# EAGLE design BLDC_logic_v2 (EAGLE 9.6.2)
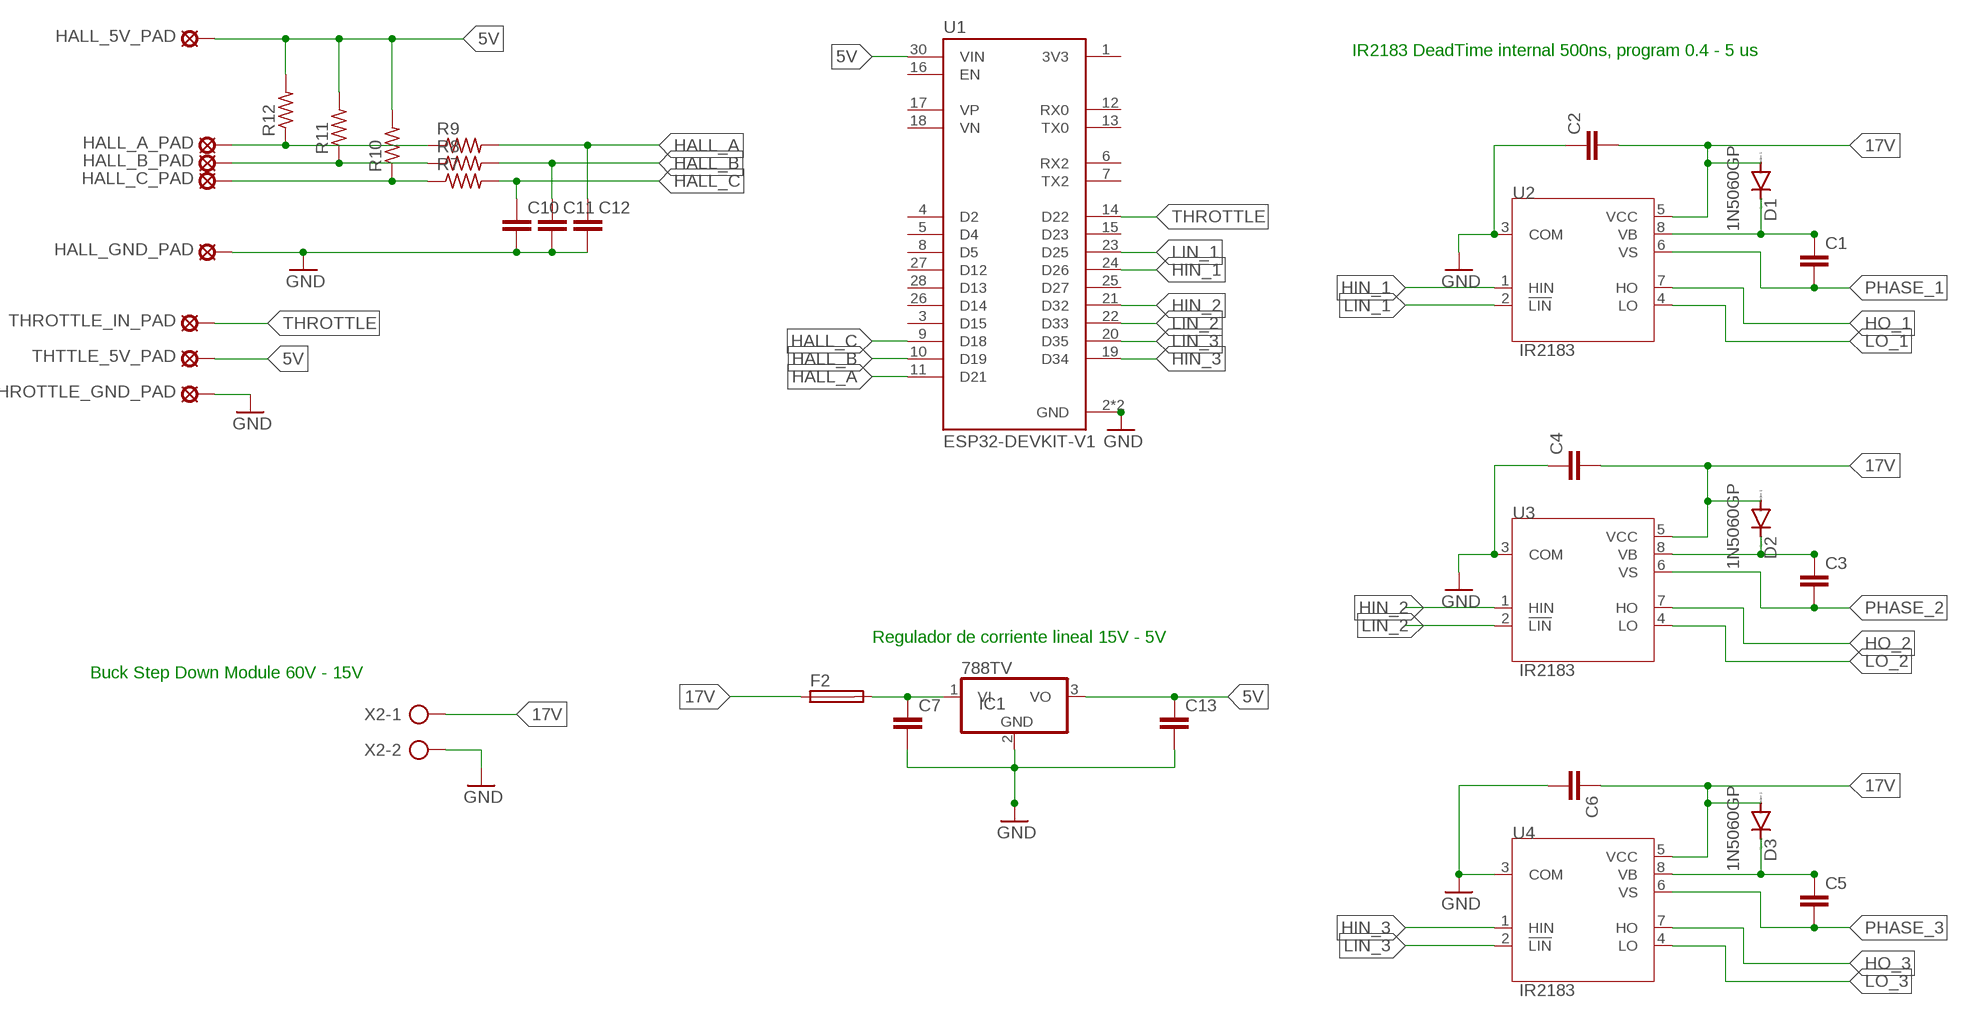
[diagram p0: schematic, sheet 1]

## Parts
C1  C-EU025-030X050  [C025-030X050]
C2  C-EU025-030X050  [C025-030X050]
C3  C-EU025-030X050  [C025-030X050]
C4  C-EU025-030X050  [C025-030X050]
C5  C-EU025-030X050  [C025-030X050]
C6  C-EU025-030X050  [C025-030X050]
C7  C-EU025-030X050  [C025-030X050]
C10  C-EU025-030X050  [C025-030X050]
C11  C-EU025-030X050  [C025-030X050]
C12  C-EU025-030X050  [C025-030X050]
C13  C-EU025-030X050  [C025-030X050]
D1  1N5060GP  [DO15-12]
D2  1N5060GP  [DO15-12]
D3  1N5060GP  [DO15-12]
F2  SH22,5  [SH22,5]
HALL_5V_PAD  MCS08  [MCS08]
HALL_A_PAD  MCS08  [MCS08]
HALL_B_PAD  MCS08  [MCS08]
HALL_C_PAD  MCS08  [MCS08]
HALL_GND_PAD  MCS08  [MCS08]
IC1  788TV  [TO220V]
R7  R-US_0204/7  [0204/7]
R8  R-US_0204/7  [0204/7]
R9  R-US_0204/7  [0204/7]
R10  R-US_0204/7  [0204/7]
R11  R-US_0204/7  [0204/7]
R12  R-US_0204/7  [0204/7]
THROTTLE_GND_PAD  MCS08  [MCS08]
THROTTLE_IN_PAD  MCS08  [MCS08]
THTTLE_5V_PAD  MCS08  [MCS08]
U1  ESP32-DEVKIT-V1  [MODULE_ESP32_DEVKIT_V1]
U2  IR2183  [DIP762W45P254L1092H533Q8]
U3  IR2183  [DIP762W45P254L1092H533Q8]
U4  IR2183  [DIP762W45P254L1092H533Q8]
X2  AK500/2-H  [AK500/2-H]

## Nets
5V: C13.1 HALL_5V_PAD.MP IC1.3(VO) R10.2 R11.2 R12.2 THTTLE_5V_PAD.MP U1.30(VIN)
17V: C2.2 C4.2 C6.1 D1.A D2.A D3.A F2.1 U2.5(VCC) U3.5(VCC) U4.5(VCC) X2.1
GND: C2.1 C4.1 C6.2 C7.2 C10.2 C11.2 C12.2 C13.2 HALL_GND_PAD.MP IC1.2(GND) THROTTLE_GND_PAD.MP U1.2(GND) U1.29(GND) U2.3(COM) U3.3(COM) U4.3(COM) X2.2
HALL_A: C12.1 R9.2 U1.11(D21)
HALL_B: C11.1 R8.2 U1.10(D19)
HALL_C: C10.1 R7.2 U1.9(D18)
HIN_1: U1.24(D26) U2.1(HIN)
HIN_2: U1.21(D32) U3.1(HIN)
HIN_3: U1.19(D34) U4.1(HIN)
HO_1: U2.7(HO)
HO_2: U3.7(HO)
HO_3: U4.7(HO)
LIN_1: U1.23(D25) U2.2(!LIN)
LIN_2: U1.22(D33) U3.2(!LIN)
LIN_3: U1.20(D35) U4.2(!LIN)
LO_1: U2.4(LO)
LO_2: U3.4(LO)
LO_3: U4.4(LO)
N$1: C3.1 D2.C U3.8(VB)
N$2: C5.1 D3.C U4.8(VB)
N$3: C1.1 D1.C U2.8(VB)
N$13: C7.1 F2.2 IC1.1(VI)
N$14: HALL_A_PAD.MP R9.1 R12.1
N$15: HALL_B_PAD.MP R8.1 R11.1
N$16: HALL_C_PAD.MP R7.1 R10.1
PHASE_1: C1.2 U2.6(VS)
PHASE_2: C3.2 U3.6(VS)
PHASE_3: C5.2 U4.6(VS)
THROTTLE: THROTTLE_IN_PAD.MP U1.14(D22)
Unconnected: U1.1(3V3) U1.3(D15) U1.4(D2) U1.5(D4) U1.6(RX2) U1.7(TX2) U1.8(D5) U1.12(RX0) U1.13(TX0) U1.15(D23) U1.16(EN) U1.17(VP) U1.18(VN) U1.25(D27) U1.26(D14) U1.27(D12) U1.28(D13)

## Notes on the sheet
- IR2183 DeadTime internal 500ns, program 0.4 - 5 us
- Regulador de corriente lineal 15V - 5V
- Buck Step Down Module 60V - 15V

## Library data of the parts
C1-C7 C10-C13 = rcl:C-EU: CAPACITOR, European symbol; SPICEPREFIX: C
D1-D3 = diode:1N5060GP: DIODE controlled avalanche rectifier
F2 = fuse:SH22,5: FUSE HOLDER grid 22,5 mm, OGN0031 8201, Schurter (Buerklin); MF: SCHURTER; MPN: 0031.8201; OC_FARNELL: 1162740; OC_NEWARK: 96F8317
HALL_5V_PAD HALL_A_PAD HALL_B_PAD HALL_C_PAD HALL_GND_PAD THROTTLE_GND_PAD THROTTLE_IN_PAD THTTLE_5V_PAD = solpad:MCS08: SOLDER PAD MC S0,8, drill 1.2 mm, distributor Buerklin, 08F130
IC1 = linear:78*: Positive VOLTAGE REGULATOR Source: http://cache.national.com/ds/LM/LM78L05.pdf http://www.fairchildsemi.com/ds/LM/LM7805.pdf
R7-R12 = rcl:R-US_: RESISTOR, American symbol; SPICEPREFIX: R
U1 = ESP32-DEVKIT-V1:ESP32-DEVKIT-V1: Dual core, Wi-Fi: 2.4 GHz up to 150 Mbits/s,BLE (Bluetooth Low Energy) and legacy Bluetooth, 32 bits, Up to 240 MHz Check availability <https://pricing.snapeda.com/parts/ESP32-DEVKIT-V1/Do%20it/view-part?ref=eda>; AVAILABILITY: Not in stock; DESCRIPTION: Dual core, Wi-Fi: 2.4 GHz up to 150 Mbits/s,BLE (Bluetooth Low Energy) and legacy Bluetooth, 32 bits, Up to 240 MHz; MF: Do it; MP: ESP32-DEVKIT-V1; PACKAGE: None; PRICE: None
U2-U4 = IR2183:IR2183: MOSFET DRVR 600V 2.3A 2-OUT Hi/Lo Side Half Brdg Inv/Non-Inv 8-Pin PDIP Check availability <https://pricing.snapeda.com/parts/IR2183/Infineon/view-part?ref=eda>; AVAILABILITY: In Stock; DESCRIPTION: Half-Bridge Gate Driver IC Inverting, Non-Inverting 14-SOIC; MF: Infineon; MP: IR2183; PACKAGE: DIP-8 International Rectifier; PRICE: None; PURCHASE-URL: https://pricing.snapeda.com/search/part/IR2183/?ref=eda
X2 = con-ptr500:AK500/2-H: CONNECTOR Aug. 2004 / PTR Meßtechnik: Die Bezeichnung der Serie AK505 wurde geändert. Es handelt sich hierbei um AK500 in horizontaler Ausführung.; OC_FARNELL: unknown; OC_NEWARK: unknown

## Module HOLE
Ports: 

### Library data of the parts

## Net classes
0 default: clearance 0.205 mm

## Board
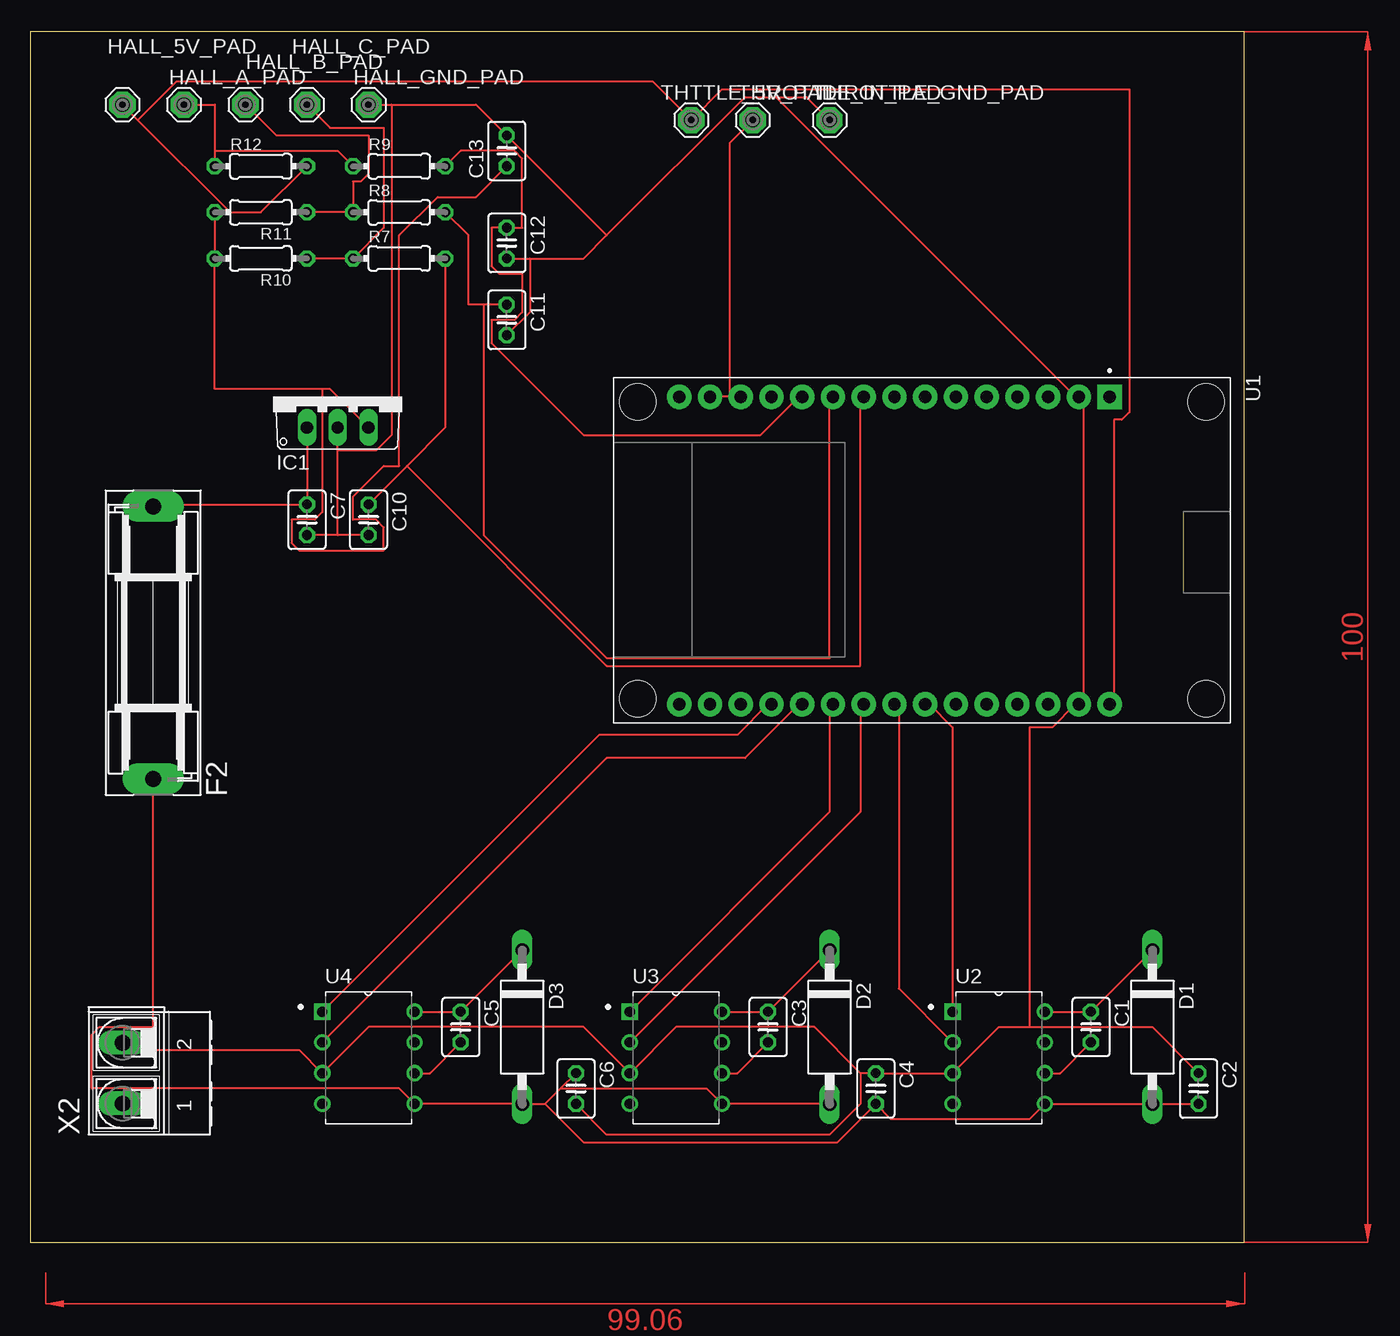
[diagram p1: board, top side]

Size 100.31 x 100 mm. Coordinates in mm from the lower left corner, seen from the top.
Outline: 0,0 100.31,0 100.31,100 0,100 0,0
Copper layers (1*16): Top 0.035mm / dielectric 1.5mm / Bottom 0.035mm
Design rules "default *": minimum track width 1mm, minimum drill 0.35mm, track to track 0.8mm, track to pad 0.8mm, pad to pad 6mil, via to via 6mil, smd to smd 6mil, copper to edge 40mil, drill to drill 6mil, minimum pad ring 10mil, minimum via ring 8mil, stop-mask expansion 4mil, vias tented up to drill 0mil, thermal gap 10mil

### Footprints (pad centres in the part's own frame; a part is rotated, then mirrored left to right if it is on the bottom)
C025-030X050 = drill 0.813 octagon: 1 -1.27,0; 2 1.27,0
DO15-12 = drill 1.118 long: A 6.35,0; C -6.35,0
SH22,5 = drill 1.321 pad 2.54 long: 1 -11.252,0; 2 11.252,0
MCS08 = drill 1.194 pad 2.159 octagon: MP 0,0
TO220V = drill 1.016 long: 1 -2.54,-2.54; 2 0,-2.54; 3 2.54,-2.54
0204/7 = drill 0.813 octagon: 1 -3.81,0; 2 3.81,0
MODULE_ESP32_DEVKIT_V1 = drill 1.02 pad 2 square: 1 -12.7,15.515 | drill 1.02 pad 2: 2 -12.7,12.975; 3 -12.7,10.435; 4 -12.7,7.895; 5 -12.7,5.355; 6 -12.7,2.815; 7 -12.7,0.275; 8 -12.7,-2.265; 9 -12.7,-4.805; 10 -12.7,-7.345; 11 -12.7,-9.885; 12 -12.7,-12.425; 13 -12.7,-14.965; 14 -12.7,-17.505; 15 -12.7,-20.045; 16 12.7,-20.045; 17 12.7,-17.505; 18 12.7,-14.965; 19 12.7,-12.425; 20 12.7,-9.885; 21 12.7,-7.345; 22 12.7,-4.805; 23 12.7,-2.265; 24 12.7,0.275; 25 12.7,2.815; 26 12.7,5.355; 27 12.7,7.895; 28 12.7,10.435; 29 12.7,12.975; 30 12.7,15.515 | hole 3: -12.28,-23.475; 12.23,-23.475; 12.23,23.475; -12.28,23.475
DIP762W45P254L1092H533Q8 = drill 0.83 square: 1 -3.81,3.81 | drill 0.83: 2 -3.81,1.27; 3 -3.81,-1.27; 4 -3.81,-3.81; 5 3.81,-3.81; 6 3.81,-1.27; 7 3.81,1.27; 8 3.81,3.81
AK500/2-H = drill 1.321 long: 1 -2.515,0; 2 2.515,0

### Placement (x,y rotation side)
C1  87.63,17.78 270 top
C2  96.52,12.7 270 top
C3  60.96,17.78 270 top
C4  69.85,12.7 270 top
C5  35.56,17.78 270 top
C6  45.09,12.7 270 top
C7  22.86,59.69 270 top
C10  27.94,59.69 270 top
C11  39.37,76.2 270 top
C12  39.37,82.55 270 top
C13  39.37,90.17 90 top
D1  92.71,17.78 270 top
D2  66.04,17.78 270 top
D3  40.64,17.78 270 top
F2  10.16,49.53 90 top
HALL_5V_PAD  7.62,93.98 0 top
HALL_A_PAD  12.7,93.98 0 top
HALL_B_PAD  17.78,93.98 0 top
HALL_C_PAD  22.86,93.98 0 top
HALL_GND_PAD  27.94,93.98 0 top
IC1  25.4,69.85 0 top
R7  30.48,81.28 0 top
R8  30.48,85.09 0 top
R9  30.48,88.9 0 top
R10  19.05,81.28 180 top
R11  19.05,85.09 180 top
R12  19.05,88.9 0 top
THROTTLE_GND_PAD  66.04,92.71 0 top
THROTTLE_IN_PAD  59.69,92.71 0 top
THTTLE_5V_PAD  54.61,92.71 0 top
U1  73.66,57.15 270 top
U2  80.01,15.24 0 top
U3  53.34,15.24 0 top
U4  27.94,15.24 0 top
X2  7.62,13.97 90 top

### Tracks (layer width: path | path; a pad name or v marks a point on that pad's centre or on a via)
5V
  Top 0.152: R12.2 19.05,85.09 16.51,85.09 | 16.51,85.09 R11.2 R10.2 15.24,70.48 24.13,70.48 | 16.51,85.09 8.89,92.71 | 8.89,92.71 HALL_5V_PAD.MP | C13.1 36.83,86.36 33.66,86.36 30.48,83.19 30.48,64.14 29.21,64.14 26.67,61.59 26.67,59.69 28.58,59.69 29.21,59.05 29.21,57.15 22.23,57.15 21.59,57.78 21.59,59.69 23.5,59.69 24.13,60.33 24.13,70.48 | 24.13,70.48 24.77,70.48 IC1.3 | U1.30 89.53,44.45 89.53,67.94 90.17,67.94 90.81,68.58 90.81,95.25 57.15,95.25 THTTLE_5V_PAD.MP 51.44,95.89 12.06,95.89 8.89,92.71
17V
  Top 0.152: C2.2 D1.A U2.5 82.55,10.16 71.12,10.16 C4.2 66.67,8.26 45.72,8.26 42.55,11.43 | D2.A U3.5 55.88,12.7 43.81,12.7 | 42.55,11.43 43.81,12.7 | 43.81,12.7 C6.1 | 42.55,11.43 D3.A U4.5 30.48,12.7 8.25,12.7 | 8.25,12.7 7.62,12.06 X2.1 | F2.1 10.16,17.78 5.72,17.78 5.08,17.14 5.08,12.7 8.25,12.7
GND
  Top 0.152: C2.1 92.71,17.78 82.55,17.78 | 82.55,17.78 80.01,17.78 U2.3 C4.1 68.58,13.97 | X2.2 7.62,15.88 22.23,15.88 U4.3 27.94,17.78 45.72,17.78 U3.3 53.34,17.78 64.77,17.78 68.58,13.97 | C6.2 47.62,8.89 66.04,8.89 68.58,11.43 68.58,13.97 | C10.2 25.4,58.42 | 25.4,58.42 C7.2 | 25.4,58.42 25.4,65.41 | 25.4,65.41 IC1.2 | HALL_GND_PAD.MP 29.84,93.98 | 29.84,93.98 36.83,93.98 C13.2 47.62,83.19 | 25.4,65.41 28.58,65.41 29.84,66.67 29.84,93.98 | C11.2 41.28,76.83 41.28,81.28 | C12.2 41.28,81.28 | THROTTLE_GND_PAD.MP 64.14,94.61 61.59,94.61 | 61.59,94.61 59.06,94.61 47.62,83.19 | 47.62,83.19 45.72,81.28 41.28,81.28 | 61.59,94.61 86.36,69.85 U1.2 87,69.85 87,44.45 U1.29 86.36,44.45 84.46,42.55 82.55,42.55 82.55,17.78
HALL_A
  Top 0.152: R9.2 35.56,90.17 40,90.17 40.64,89.53 40.64,83.82 C12.1 38.1,83.82 38.1,80.64 38.73,80.01 40.64,80.01 40.64,76.83 40,76.2 38.1,76.2 38.1,74.3 45.72,66.67 60.33,66.67 63.5,69.85 U1.11
HALL_B
  Top 0.152: R8.2 36.2,83.19 36.2,77.47 37.47,77.47 | C11.1 37.47,77.47 | 37.47,77.47 37.47,58.42 47.62,48.26 66.04,48.26 66.04,69.85 U1.10
HALL_C
  Top 0.152: 31.12,64.14 34.29,67.31 R7.2 | 31.12,64.14 C10.1 | 31.12,64.14 47.62,47.62 68.58,47.62 68.58,69.85 U1.9
HIN_1
  Top 0.152: U2.1 76.2,42.55 74.3,44.45 U1.24
HIN_2
  Top 0.152: U3.1 66.04,35.56 66.04,44.45 U1.21
HIN_3
  Top 0.152: U4.1 46.99,41.91 58.42,41.91 60.96,44.45 U1.19
LIN_1
  Top 0.152: U2.2 71.75,20.95 71.75,44.45 U1.23
LIN_2
  Top 0.152: U3.2 68.58,35.56 68.58,44.45 U1.22
LIN_3
  Top 0.152: U4.2 47.62,40.01 59.06,40.01 63.5,44.45 U1.20
N$1
  Top 0.152: U3.8 C3.1 D2.C
N$2
  Top 0.152: U4.8 C5.1 D3.C
N$3
  Top 0.152: U2.8 C1.1 D1.C
N$13
  Top 0.152: IC1.1 C7.1 10.16,60.96 F2.2
N$14
  Top 0.152: 15.24,90.17 15.24,93.98 HALL_A_PAD.MP | 15.24,90.17 R12.1 | R9.1 25.4,90.17 15.24,90.17
N$15
  Top 0.152: R11.1 R8.1 26.67,87.63 27.31,87.63 27.94,88.27 27.94,91.44 20.32,91.44 HALL_B_PAD.MP
N$16
  Top 0.152: R10.1 R7.1 29.21,83.82 29.21,92.08 24.77,92.08 HALL_C_PAD.MP
PHASE_1
  Top 0.152: C1.2 85.09,13.97 U2.6
PHASE_2
  Top 0.152: C3.2 58.42,13.97 U3.6
PHASE_3
  Top 0.152: C5.2 33.02,13.97 U4.6
THROTTLE
  Top 0.152: THROTTLE_IN_PAD.MP 57.78,90.81 57.78,69.85 U1.14
(copper drawn outside any net)
  shapes: Top area x2